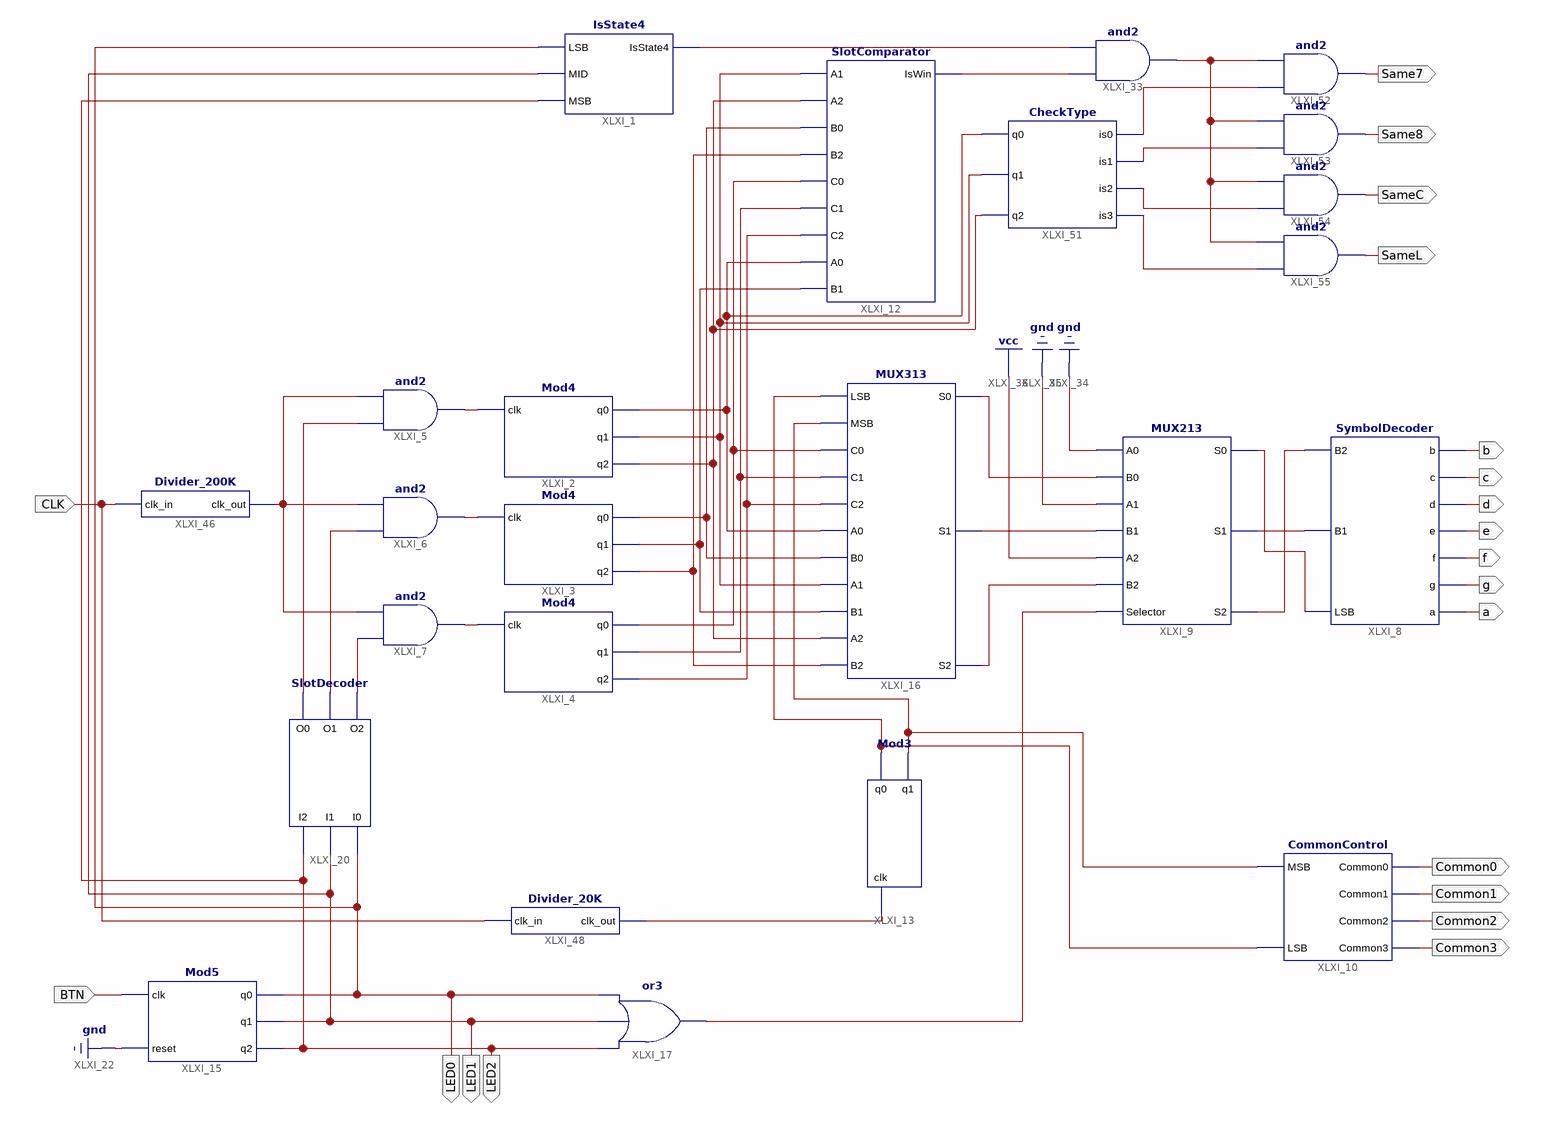
[diagram p0: schematic sheet 1]
// Xilinx ISE schematic TopLayer.sch (spartan6) as structural Verilog: 24 symbols, 20 ports
module TopLayer (
  input  BTN,
  input  CLK,
  output b,
  output c,
  output d,
  output e,
  output f,
  output g,
  output a,
  output Common0,
  output Common1,
  output Common2,
  output Common3,
  output LED0,
  output LED1,
  output LED2,
  output Same7,
  output Same8,
  output SameC,
  output SameL
);

  wire XLXN_1, XLXN_2, XLXN_3, XLXN_4, XLXN_5, XLXN_6, XLXN_18, XLXN_19, XLXN_23, XLXN_24, XLXN_25, XLXN_26,
       XLXN_27, XLXN_28, XLXN_84, XLXN_86, XLXN_87, XLXN_88, XLXN_102, XLXN_103, XLXN_104, XLXN_105,
       XLXN_106, XLXN_107, XLXN_108, XLXN_109, XLXN_110, XLXN_116, XLXN_118, XLXN_119, XLXN_120, XLXN_121,
       XLXN_122;

  IsState4 XLXI_1 (.LSB(LED0), .MID(LED1), .MSB(LED2), .IsState4(XLXN_18));
  Mod4 XLXI_2 (.clk(XLXN_1), .q0(XLXN_102), .q1(XLXN_103), .q2(XLXN_104));
  Mod4 XLXI_3 (.clk(XLXN_2), .q0(XLXN_105), .q1(XLXN_106), .q2(XLXN_107));
  Mod4 XLXI_4 (.clk(XLXN_3), .q0(XLXN_108), .q1(XLXN_109), .q2(XLXN_110));
  and XLXI_5 (XLXN_1, XLXN_86, XLXN_84);
  and XLXI_6 (XLXN_2, XLXN_87, XLXN_84);
  and XLXI_7 (XLXN_3, XLXN_88, XLXN_84);
  SymbolDecoder XLXI_8 (.B2(XLXN_6), .B1(XLXN_5), .LSB(XLXN_4), .b(b), .c(c), .d(d), .e(e), .f(f), .g(g), .a(a));
  MUX213 XLXI_9 (
    .A0(1'b0), .B0(XLXN_23), .A1(1'b0), .B1(XLXN_24), .A2(1'b1), .B2(XLXN_25), .Selector(XLXN_28),
    .S0(XLXN_4), .S1(XLXN_5), .S2(XLXN_6));
  CommonControl XLXI_10 (
    .MSB(XLXN_27), .LSB(XLXN_26), .Common0(Common0), .Common1(Common1), .Common2(Common2), .Common3(Common3));
  and XLXI_33 (XLXN_122, XLXN_19, XLXN_18);
  SlotComparator XLXI_12 (
    .A1(XLXN_103), .A2(XLXN_104), .B0(XLXN_105), .B2(XLXN_107), .C0(XLXN_108), .C1(XLXN_109), .C2(XLXN_110),
    .A0(XLXN_102), .B1(XLXN_106), .IsWin(XLXN_19));
  MUX313 XLXI_16 (
    .LSB(XLXN_26), .MSB(XLXN_27), .C0(XLXN_108), .C1(XLXN_109), .C2(XLXN_110), .A0(XLXN_102), .B0(XLXN_105),
    .A1(XLXN_103), .B1(XLXN_106), .A2(XLXN_104), .B2(XLXN_107), .S0(XLXN_23), .S1(XLXN_24), .S2(XLXN_25));
  Mod3 XLXI_13 (.clk(XLXN_116), .q0(XLXN_26), .q1(XLXN_27));
  or XLXI_17 (XLXN_28, LED2, LED1, LED0);
  Divider_200K XLXI_46 (.clk_in(CLK), .clk_out(XLXN_84));
  SlotDecoder XLXI_20 (.I2(LED2), .I1(LED1), .I0(LED0), .O0(XLXN_86), .O1(XLXN_87), .O2(XLXN_88));
  Mod5 XLXI_15 (.clk(BTN), .reset(1'b0), .q0(LED0), .q1(LED1), .q2(LED2));
  Divider_20K XLXI_48 (.clk_in(CLK), .clk_out(XLXN_116));
  and XLXI_52 (Same7, XLXN_118, XLXN_122);
  and XLXI_53 (Same8, XLXN_119, XLXN_122);
  and XLXI_54 (SameC, XLXN_120, XLXN_122);
  and XLXI_55 (SameL, XLXN_121, XLXN_122);
  CheckType XLXI_51 (
    .q0(XLXN_102), .q1(XLXN_103), .q2(XLXN_104), .is0(XLXN_118), .is1(XLXN_119), .is2(XLXN_120),
    .is3(XLXN_121));
endmodule
